# Altium schematic sheet MainBoard_sch.SchDoc
size 381 x 241 mm; SheetNumber: 1; SheetTotal: 1
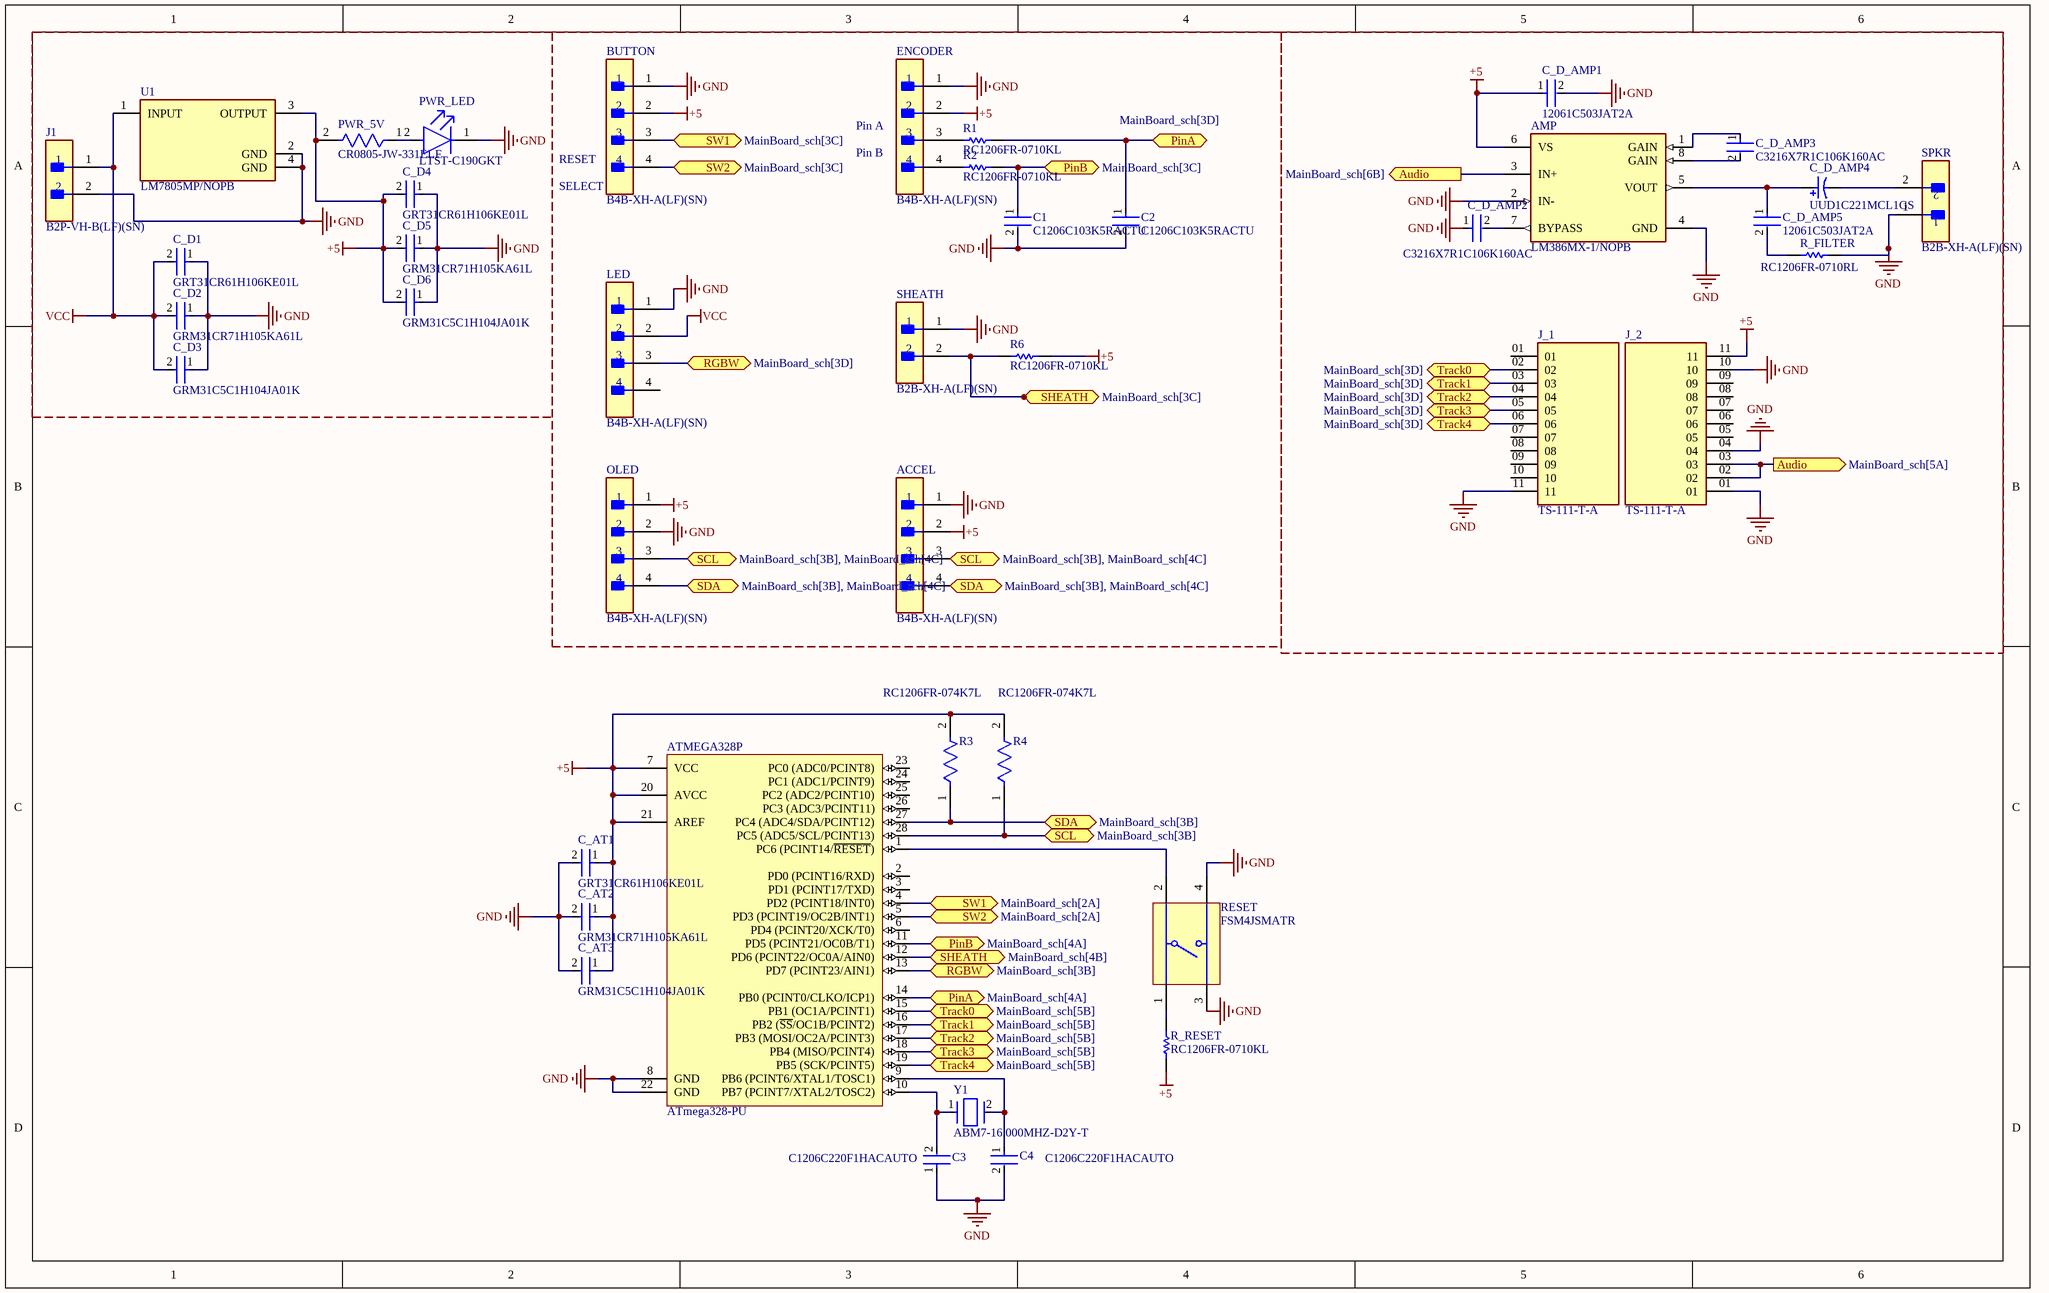
[diagram p0: MainBoard_sch.SchDoc]

## Parts
ACCEL  B4B-XH-A(LF)(SN)  [FP-B4B-XH-A_LF_SN-MFG]
AMP  LM386MX-1/NOPB  [FP-D0008A-IPC_B]
ATMEGA328P  ATmega328-PU  [28P3]
BUTTON  B4B-XH-A(LF)(SN)  [FP-B4B-XH-A_LF_SN-MFG]
C1  C1206C103K5RACTU  [FP-C1206C-EB-MFG]
C2  C1206C103K5RACTU  [FP-C1206C-EB-MFG]
C3  C1206C220F1HACAUTO  [FP-C1206C-EB-MFG]
C4  C1206C220F1HACAUTO  [FP-C1206C-EB-MFG]
C_AT1  GRT31CR61H106KE01L  [FP-GRT31C-0_2-IPC_A]
C_AT2  GRM31CR71H105KA61L  [FP-GRT31C-0_2-IPC_A]
C_AT3  GRM31C5C1H104JA01K  [FP-GRT31C-0_2-IPC_A]
C_D1  GRT31CR61H106KE01L  [FP-GRT31C-0_2-IPC_A]
C_D2  GRM31CR71H105KA61L  [FP-GRT31C-0_2-IPC_A]
C_D3  GRM31C5C1H104JA01K  [FP-GRT31C-0_2-IPC_A]
C_D4  GRT31CR61H106KE01L  [FP-GRT31C-0_2-IPC_A]
C_D5  GRM31CR71H105KA61L  [FP-GRT31C-0_2-IPC_A]
C_D6  GRM31C5C1H104JA01K  [FP-GRT31C-0_2-IPC_A]
C_D_AMP1  12061C503JAT2A  [FP-GRM319-0_15-MFG]
C_D_AMP2  C3216X7R1C106K160AC  [FP-C3216-160-0_2-IPC_B]
C_D_AMP3  C3216X7R1C106K160AC  [FP-C3216-160-0_2-IPC_B]
C_D_AMP4  UUD1C221MCL1GS  [NIC-CAPA2-6.3X7.7_V]
C_D_AMP5  12061C503JAT2A  [FP-GRM319-0_15-MFG]
ENCODER  B4B-XH-A(LF)(SN)  [FP-B4B-XH-A_LF_SN-MFG]
J1  B2P-VH-B(LF)(SN)  [FP-B2P-VH-B_LF_SN-MFG]
J_1  TS-111-T-A  [SAMTEC_TS-111-T-A]
J_2  TS-111-T-A  [SAMTEC_TS-111-T-A]
LED  B4B-XH-A(LF)(SN)  [FP-B4B-XH-A_LF_SN-MFG]
OLED  B4B-XH-A(LF)(SN)  [FP-B4B-XH-A_LF_SN-MFG]
PWR_5V  CR0805-JW-331ELF  [FP-CR0805-IPC_B]
PWR_LED  LTST-C190GKT  [FP-LTST-C190GKT-MFG]
R1  RC1206FR-0710KL  [RESC3116X65X40ML10T20]
R2  RC1206FR-0710KL  [RESC3116X65X40ML10T20]
R3  RC1206FR-074K7L  [FP-RC1206-0_65-IPC_B]
R4  RC1206FR-074K7L  [FP-RC1206-0_65-IPC_B]
R6  RC1206FR-0710KL  [RESC3116X65X40ML10T20]
R_FILTER  RC1206FR-0710RL  [RESC3116X65X40ML10T20]
R_RESET  RC1206FR-0710KL  [RESC3116X65X40ML10T20]
RESET  FSM4JSMATR  [TECO-FSM4JSMATR_V]
SHEATH  B2B-XH-A(LF)(SN)  [FP-B2B-XH-A_LF_SN-MFG]
SPKR  B2B-XH-A(LF)(SN)  [FP-B2B-XH-A_LF_SN-MFG]
U1  LM7805MP/NOPB  [FP-DCY0004A-MFG]
Y1  ABM7-16.000MHZ-D2Y-T  [FP-ABM7-MFG]

## Ports
Audio (out, see MainBoard_sch[5A]), Audio (out, see MainBoard_sch[6B]), PinA (bidir, see MainBoard_sch[3D]), PinA (bidir, see MainBoard_sch[4A]), PinB (bidir, see MainBoard_sch[3C]), PinB (bidir, see MainBoard_sch[4A]), RGBW (bidir, see MainBoard_sch[3B]), RGBW (bidir, see MainBoard_sch[3D]), SCL (bidir, see MainBoard_sch[3B]), SCL (bidir, see MainBoard_sch[3B], MainBoard_sch[4C]), SDA (bidir, see MainBoard_sch[3B]), SDA (bidir, see MainBoard_sch[3B], MainBoard_sch[4C]), SHEATH (bidir, see MainBoard_sch[3C]), SHEATH (bidir, see MainBoard_sch[4B]), SW1 (bidir, see MainBoard_sch[2A]), SW1 (bidir, see MainBoard_sch[3C]), SW2 (bidir, see MainBoard_sch[2A]), SW2 (bidir, see MainBoard_sch[3C]), Track0 (bidir, see MainBoard_sch[3D]), Track0 (bidir, see MainBoard_sch[5B]), Track1 (bidir, see MainBoard_sch[3D]), Track1 (bidir, see MainBoard_sch[5B]), Track2 (bidir, see MainBoard_sch[3D]), Track2 (bidir, see MainBoard_sch[5B]), Track3 (bidir, see MainBoard_sch[3D]), Track3 (bidir, see MainBoard_sch[5B]), Track4 (bidir, see MainBoard_sch[3D]), Track4 (bidir, see MainBoard_sch[5B])

## Nets
+5: ACCEL.2 AMP.6(VS) ATMEGA328P.7(VCC) ATMEGA328P.20(AVCC) ATMEGA328P.21(AREF) BUTTON.2 C_AT1.1 C_AT2.1 C_AT3.1 C_D4.2 C_D5.2 C_D6.2 C_D_AMP1.1 ENCODER.2 J_2.11 OLED.1 PWR_5V.2 R3.2 R4.2 R6.1 R_RESET.2 U1.3(OUTPUT)
GND: ACCEL.1 AMP.2(IN-) AMP.4(GND) ATMEGA328P.8(GND) ATMEGA328P.22(GND) BUTTON.1 C1.2 C2.2 C3.1 C4.2 C_AT1.2 C_AT2.2 C_AT3.2 C_D1.1 C_D2.1 C_D3.1 C_D4.1 C_D5.1 C_D6.1 C_D_AMP1.2 C_D_AMP2.1 ENCODER.1 J1.2 J_1.11 J_2.01 J_2.04 J_2.10 LED.1 OLED.2 PWR_LED.1(C) R_FILTER.2 RESET.3 RESET.4 SHEATH.1 SPKR.1 U1.2(GND) U1.4(GND)
VCC: C_D1.2 C_D2.2 C_D3.2 J1.1 LED.2 U1.1(INPUT)
Audio: AMP.3(IN+) J_2.02 J_2.03 ; port Audio
PinA: ATMEGA328P.14(PB0_(PCINT0/CLKO/ICP1)) C2.1 R1.2 ; port PinA
PinB: ATMEGA328P.11(PD5_(PCINT21/OC0B/T1)) C1.1 R2.2 ; port PinB
RGBW: ATMEGA328P.13(PD7_(PCINT23/AIN1)) LED.3 ; port RGBW
SCL: ACCEL.3 ATMEGA328P.28(PC5_(ADC5/SCL/PCINT13)) OLED.3 R4.1 ; port SCL
SDA: ACCEL.4 ATMEGA328P.27(PC4_(ADC4/SDA/PCINT12)) OLED.4 R3.1 ; port SDA
SHEATH: ATMEGA328P.12(PD6_(PCINT22/OC0A/AIN0)) R6.2 SHEATH.2 ; port SHEATH
SW1: ATMEGA328P.4(PD2_(PCINT18/INT0)) BUTTON.3 ; port SW1
SW2: ATMEGA328P.5(PD3_(PCINT19/OC2B/INT1)) BUTTON.4 ; port SW2
Track0: ATMEGA328P.15(PB1_(OC1A/PCINT1)) J_1.02 ; port Track0
Track1: ATMEGA328P.16(PB2_(~{SS}/OC1B/PCINT2)) J_1.03 ; port Track1
Track2: ATMEGA328P.17(PB3_(MOSI/OC2A/PCINT3)) J_1.04 ; port Track2
Track3: ATMEGA328P.18(PB4_(MISO/PCINT4)) J_1.05 ; port Track3
Track4: ATMEGA328P.19(PB5_(SCK/PCINT5)) J_1.06 ; port Track4
NetAMP_1: AMP.1(GAIN) C_D_AMP3.1
NetAMP_5: AMP.5(VOUT) C_D_AMP4.1 C_D_AMP5.1
NetAMP_7: AMP.7(BYPASS) C_D_AMP2.2
NetAMP_8: AMP.8(GAIN) C_D_AMP3.2
NetATMEGA328P_1: ATMEGA328P.1(PC6_(PCINT14/~{RESET})) RESET.2
NetATMEGA328P_9: ATMEGA328P.9(PB6_(PCINT6/XTAL1/TOSC1)) C4.1 Y1.2
NetATMEGA328P_10: ATMEGA328P.10(PB7_(PCINT7/XTAL2/TOSC2)) C3.2 Y1.1
NetC_D_AMP4_2: C_D_AMP4.2 SPKR.2
NetC_D_AMP5_2: C_D_AMP5.2 R_FILTER.1
NetENCODER_3: ENCODER.3 R1.1
NetENCODER_4: ENCODER.4 R2.1
NetPWR_5V_1: PWR_5V.1 PWR_LED.2(A)
NetR_RESET_1: R_RESET.1 RESET.1

Not connected (* = marked no-connect by the designer): ATMEGA328P 2(PD0_(PCINT16/RXD)) 3(PD1_(PCINT17/TXD)) 6(PD4_(PCINT20/XCK/T0)) 23(PC0_(ADC0/PCINT8)) 24(PC1_(ADC1/PCINT9)) 25(PC2_(ADC2/PCINT10)) 26(PC3_(ADC3/PCINT11)); J_1 01 07 08 09 10; J_2 05 06 07 08 09; LED 4

## Notes on the sheet
- (near BUTTON) RESET
- (near ENCODER) Pin A
- (near ENCODER) Pin B
- (near BUTTON) SELECT

## Library data of the parts
ACCEL BUTTON ENCODER LED OLED = CMP-17439-000250-1: CONN HEADER VERT 4POS 2.5MM; Number of Contacts: 4; Contact Resistance: 20mR; Voltage Rating: 250V; Max Current Rating: 3A; Gender: Male; Wire/Cable Gauge: 22AWG; Mated Stacking Heights: 9.8mm; Insulation Resistance: 1GR; Orientation: Straight; Contact Type: Male Pin; Contact Finish - Mating: TIN; Series: XH; Max Voltage Rating (AC): 250V; Lead Pitch: 2.5mm; Contact Shape: Square; Insulation Color: Natural; Termination: Solder; Lead Free: Lead Free; Voltage Rating (AC): 250V; Number of Rows: 1; Flammability Rating: UL94 V-0; Number of Positions: 4; Max Operating Temperature: 85°C; Package Quantity: 500; Mount: Through Hole; REACH SVHC: No SVHC; Connector Type: Header; Insulation Material: Nylon; Fastening Type: Detent; Min Operating Temperature: -25°C; Housing Color: White; Packaging: Bulk; Contact Plating: Tin; Contact Material: Brass; Max Voltage Rating (DC): 250V; Housing Material: Polyamide; Color: Natural; Material: Polyamide; Pitch: 2.5mm; Depth: 5.75mm; Current Rating: 3A; Length: 12.4mm
AMP = CMP-0994-00003-2: IC AMP CLASS AB MONO 325MW 8SOIC; Max Power Dissipation: 730mW; Nominal Supply Current: 4mA; Voltage Gain: 46dB; Power Supply Rejection Ratio (PSRR): 50dB; Gain: 20dB; Max Supply Voltage: 12V; Load Impedance: 8R; Min Supply Voltage: 4V; Bandwidth: 300kHz; Input Bias Current: 250nA; Supply Type: Single; Number of Channels: 1; Operating Supply Voltage: 9V; Case/Package: D; Power Dissipation: 730mW; Max Output Power: 325mW; Lead Free: Lead Free; Supply Current: 4mA; Number of Pins: 8; Contact Plating: Tin; RoHS Compliant: Yes; Packaging: Tape and Reel; Min Operating Temperature: 0°C; REACH SVHC: No SVHC; Output Power: 325mW; Package Quantity: 2500; Max Operating Temperature: 70°C; Radiation Hardening: No; Series: LM386
ATMEGA328P = CMP-0095-00015-2: 8-bit AVR Microcontroller, 32KB Flash, 1KB EEPROM, 2KB SRAM, 28-pin PDIP, Industrial Grade (-40°C to 85°C); ComponentLink3Description: ATmega48A/48PA/88A/88PA/168A/168PA/328/328P Summary; RevisionNote: DatasheetVersion updated. URLs added.; DatasheetVersion: revD, May-2011; ComponentLink1URL: http://www.atmel.com/; PackageVersion: revB, Sep-2001; PackageDescription: 28-lead (0.300"/7.62mm Wide) Plastic Dual Inline Package (PDIP); PackageReference: 28P3; ComponentLink1Description: Manufacturer URL; ComponentLink2Description: ATmega48A/48PA/88A/88PA/168A/168PA/328/328P Datasheet; ComponentLink3URL: http://www.atmel.com/dyn/resources/prod_documents/8271S.pdf; ComponentLink2URL: http://www.atmel.com/dyn/resources/prod_documents/8271.pdf
C1 C2 = CMP-2000-06008-2: CAP CER 10000PF 50V X7R 1206; Manufacturer: KEMET; Material: Ceramic; Temperature Coefficient: 15%; Capacitance: 10,000 pF; Automotive Grade: Grade 0; Value: 10,000 pF; Tolerance: 0.1; Height: 0.88mm; Digikey Description: CAP CER 10000PF 50V X7R 1206; Temperature Range Low: -55°C; Temperature: -55°C to +150°C; Temperature Range High: +150°C; Automotive: Yes; RoHS: TRUE; Lead Free: Yes; Device Class L3: Ceramic Capacitors; Device Class L2: Capacitors; Device Class L1: Passive Components; Octopart: https://octopart.com/c1206c103k5ractu-kemet-130245; Category: Cap; ComponentLink2Description: Datasheet; Mouser Description: Multilayer Ceramic Capacitors MLCC - SMD/SMT 50volts 10000pF X7R 10%; ComponentLink2URL: https://content.kemet.com/datasheets/KEM_C1007_X8R_ULTRA_150C_SMD.pdf; Voltage Rating: 50 V; Package: C1206C-EB; Manufacturer Part Number: C1206C103K5RACTU; Temperature Characteristic: X7R; Ipc Land Pattern Name: CAPC320160X78
C3 C4 = CMP-03020-023717-1: C1206 22 pF X8R 1.00% 100 V; Manufacturer: KEMET; Automotive Grade: Grade 0; Capacitance: 22 pF; Tolerance: 0.01; Temperature Coefficient: 15%; Voltage Rating: 100 V; Value: 22 pF; Material: Ceramic; ComponentLink2Description: Datasheet; Manufacturer Part Number: C1206C220F1HACAUTO; RoHS: TRUE; Temperature Range High: +150°C; Ipc Land Pattern Name: CAPC320160X78; Package: C1206C-EB; Device Class L3: Ceramic Capacitors; Height: 0.88mm; Lead Free: Yes; Device Class L2: Capacitors; Category: Cap; Automotive: Yes; Temperature Characteristic: X8R; ComponentLink2URL: https://content.kemet.com/datasheets/KEM_C1007_X8R_ULTRA_150C_SMD.pdf; Device Class L1: Passive Components; Temperature Range Low: -55°C; Temperature: -55°C to +150°C; Octopart: https://octopart.com/c1206c220f1hacauto-kemet-88102108
C_AT1-C_AT3 C_D1-C_D6 = CMP-06035-000076-2: Multi-Layer Ceramic Capacitor 10uF 50V X5R ±10% 1206 Emboss T/R; Length: 0.126inch; Max Operating Temperature: 85°C; Width: 0.063inch; Ratings: AEC-Q200; Voltage Rating: 50V; Dielectric: X5R; Min Operating Temperature: -55°C; Case Code (Imperial): 1206; Capacitance: 10uF; Case Code (Metric): 3216; Thickness: 0.071inch; Tolerance: 10%; Mount: Surface Mount; Case/Package: 1206; Packaging: Cut Tape; Voltage Rating (DC): 50V
C_D_AMP1 = CMP-06035-028588-1: Chip Multilayer Ceramic Capacitors for General Purpose, 1206, 0.05uF, C0G, 30ppm/°C, 5%, 50V
C_D_AMP2 C_D_AMP3 = CMP-08246-002980-1: Multilayer Ceramic Capacitors 10uF ±10% 16V X7R SMD 1206; Termination: SMD/SMT; Package Quantity: 1; Min Operating Temperature: -55°C; Case Code (Imperial): 1206; Resistor Type: Ceramic; Number of Pins: 2; Lead Free: Lead Free; RoHS Compliant: Yes; Packaging: Tape and Reel; Dielectric: X7R; Thickness: 0.071inch; Tolerance: 10%; Voltage Rating (DC): 16V; Length: 3.2mm; Voltage Rating: 16V; Voltage: 16V; Capacitance: 10uF; REACH SVHC: No SVHC; Series: C; Height: 1.6mm; Construction: Flat; Case/Package: 1206; Max Operating Temperature: 125°C; Case Code (Metric): 3216; Depth: 1.6mm; Weight: 0.000571oz; Dielectric Material: Ceramic; Width: 0.063inch; Mount: Surface Mount
C_D_AMP4 = CMP-0687-00060-1: Aluminum Electrolytic Capacitor, UD Series, Low Impedance, 220 uF, 16 V, + / - 20%, -55 to 105 degC, Chip Type, 6.3 x 7.7 mm D x L, Pb-Free, Reel; Manufacturer: Nichicon; Impedance: 0.34 Ohm; Tolerance Rated Capacitance: -20 to 20%; Rated Voltage: 16 V; Rated Capacitance: 220 uF; Endurance Time: 2000 h; Rated Ripple Current (at 100kHz): 280 mA; Packing: Dia382mm Reel; PackageReference: CAPAE-D6.3H7.7; DatasheetVersion: 08/2012; PartNumber: UUD1C221MCL1GS; ComponentLink1URL: http://www.nichicon.co.jp/; ComponentLink3URL: http://products.nichicon.co.jp/en/pdf/XJA043/e-ud.pdf; PackageDescription: 2-Pin Surface Mount Device, Diameter 6.3 mm, Height 7.7 mm, Pitch 5.4 mm; ComponentLink3Description: Package Specification; Length: 7.7 mm; RoHS: TRUE; Mounting Technology: Surface Mount; ComponentLink2Description: Datasheet; ComponentLink2URL: http://products.nichicon.co.jp/en/pdf/XJA043/e-ud.pdf; Diameter: 6.3 mm; ComponentLink1Description: Manufacturer URL
C_D_AMP5 = CMP-06035-028588-1: Chip Multilayer Ceramic Capacitors for General Purpose, 1206, 0.10uF, C0G, 30ppm/°C, 5%, 50V
J1 = CMP-17439-000297-1: CONN HEADER VERT 2POS 3.96MM; Number of Positions: 2; Pitch: 0.156inch; Voltage Rating: 250V; Termination: Solder; Lead Free: Lead Free; Insulation Color: Natural; Contact Material: Brass; Flammability Rating: UL94 V-0; Packaging: Bulk; Contact Mating Length: 0.303inch; Color: Natural; Contact Shape: Square; Contact Plating: Tin; Number of Rows: 1; Insulation Material: PBT; Connector Type: Header; Contact Finish - Mating: TIN; Mount: Through Hole; Fastening Type: Friction; Contact Type: Male Pin; Series: VH
J_1 J_2 = TS-111-T-A: MF: {'manufacturer': u'Samtec Inc.'}; Package: None; Price: None; Value: *; MP: TS-111-T-A; Availability: Unavailable
PWR_5V = CMP-07231-005909-1: Thick Film Chip Resistors 0805 330Ω 0.125W 5% 200ppm/°C; Voltage Rating (DC): 150V; Max Power Dissipation: 125mW; Resistance: 330R; Min Operating Temperature: -55°C; Number of Terminations: 2; Width: 0.049inch; Number of Pins: 2; REACH SVHC: No SVHC; Contact Plating: Tin; Max Operating Temperature: 155°C; Mount: Surface Mount; Case Code (Metric): 2012; Length: 2mm; Package Quantity: 1; Tolerance: 5%; Composition: Thick Film; Packaging: Tape and Reel; Case Code (Imperial): 0805; Radiation Hardening: No; Height: 0.024inch; Thickness: 508um; Case/Package: 0805; Termination: SMD/SMT; Voltage Rating: 150V; Power Rating: 125mW; Depth: 1.25mm; Temperature Coefficient: 200ppm/°C; Features: Moisture Resistant; Military Standard: Not
PWR_LED = CMP-22017-000005-2: LED GREEN CLEAR CHIP SMD; Dominant Wavelength: 569nm; Reverse Voltage: 5V; Lens Color: Colorless; Viewing Angle: 130°; Voltage: 2V; Forward Current: 30mA; Power Dissipation: 100mW; Luminous Intensity: 6mcd; Number of LEDs: 1; Forward Voltage: 2.1V; Wavelength: 565nm; Test Current: 10mA; Min Operating Temperature: -55°C; Lens Style: Clear; Mount: Surface Mount; Width: 0.8mm; Packaging: Tape and Reel; Lens Transparency: Clear; Case Code (Metric): 1608; Depth: 0.8mm; Case Code (Imperial): 0603; Case/Package: 0603; Number of Pins: 2; Max Operating Temperature: 85°C; Lead Free: Lead Free; Number of Elements: 1; Length: 1.6mm; Height: 0.8mm; Package Quantity: 1; Power Rating: 100mW; Radiation Hardening: No; Illumination Color: Green; Color: Green
R1 R2 R6 R_RESET = CMP-1014-00623-2: Chip Resistor, 10 KOhm, +/- 1%, 0.25 W, -55 to 155 degC, 1206 (3216 Metric), RoHS, Tape and Reel; Manufacturer: Yageo; Voltage Rating: 200V; Resistance: 10KOhm; Temperature Coefficient: 100ppm/degreesC; Power Rating: 250mW; Packaging: TapeandReel; Termination: SMD/SMT; REACH SVHC: Unknown; Tolerance: 1%; Height: 0.55mm; Composition: ThickFilm; Max Operating Temperature: 155degC; Datasheet Version: Rev. 5, 10/2016; Lead Free: LeadFree; Case Code (Metric): 3216; Depth: 1.6mm; Package Quantity: 5000; RoHSCompliant: true; Military Standard: Not; Case/Package: 1206; Case Code (Imperial): 1206; Min Operating Temperature: -55degC; Datasheet URL: http://www.yageo.com/NewPortal/yageodocoutput?fileName=/pdf/R-Chip/PYu-RC_Group_51_RoHS_L_5.pdf; Length: 3.1mm; Manufacturer URL: http://www.yageo.com/; Package Reference: 1206.0; Width: 1.6mm; Package Description: 2-Pin Surface Mount Device, Body 3.1 x 1.6 mm
R3 R4 = CMP-03412-037805-1: RES SMD 4.7K OHM 1% 1/4W 1206; Max Power Dissipation: 250mW; Voltage Rating: 200V; Temperature Coefficient: 100ppm/°C; Resistance: 4.7kR; Construction: Rectangular; RoHS Compliant: Yes; Max Operating Temperature: 155°C; Tolerance: 1%; Height: 0.026inch; Features: Moisture Resistant; Military Standard: Not; Series: RC; Termination: SMD/SMT; Number of Terminations: 2; Number of Pins: 2; Case Code (Imperial): 1206; Case/Package: 1206; Case Code (Metric): 3216; Voltage Rating (DC): 200V; Width: 0.063inch; Min Operating Temperature: -55°C; Resistance Tolerance: 1%; Length: 0.122inch; Size Code: 1206; Lead Free: Lead Free; Depth: 1.6mm; Packaging: Tape and Reel; Package Quantity: 1; Power Rating: 250mW; Resistor Type: Thick Film
R_FILTER = CMP-2100-03677-1: Chip Resistor, 10 Ohm, +/- 1%, 0.25 W, -55 to 155 degC, 1206 (3216 Metric), RoHS, Tape and Reel; Manufacturer: Yageo; Voltage Rating (DC): 200V; Resistance: 10Ohm; Power Rating: 250mW; Temperature Coefficient: 200ppm/degreesC; Military Standard: Not; Package Description: 2-Pin Surface Mount Device, Body 3.1 x 1.6 mm; Packaging: TapeandReel; Datasheet Version: Rev. 5, 10/2016; Length: 3.1mm; Manufacturer URL: http://www.yageo.com/; Voltage Rating: 200V; Height: 0.026inch; REACH SVHC: Unknown; Max Operating Temperature: 155degC; Case Code (Imperial): 1206; Package Reference: 1206.0; RoHSCompliant: true; Termination: SMD/SMT; Lead Free: LeadFree; Composition: ThickFilm; Tolerance: 1%; Package Quantity: 1; Min Operating Temperature: -55degC; Datasheet URL: http://www.yageo.com/NewPortal/yageodocoutput?fileName=/pdf/R-Chip/PYu-RC_Group_51_RoHS_L_5.pdf; Number of Pins: 2; Width: 0.063inch; Case Code (Metric): 3216; Max Power Dissipation: 250mW; Depth: 1.6mm; Number of Terminations: 2; Case/Package: 1206
RESET = CMP-2000-07486-1: Micro Miniature Push Button Switch FSM JSM, 50 mA, -35 to 85 degC, 4-Pin SMD, RoHS, Tape and Reel; Manufacturer: TE Connectivity; Mechanical Life: 100000Cycles; Current Rating: 50mA; Actuator Material: Polyamide; Max Voltage Rating (DC): 12V; Capacitance: 0f; Illumination Type: Illuminated; Voltage Rating (DC): 24V; Case\/Package: SMD/SMT; Operating Force: 160gf; Contact Resistance: 100mOhm; Actuator Length: 0.055inch; Switch Travel: 0.25mm; Throw Configuration: SPST; Termination: GullWing; Contact Plating: Silver; Orientation: Straight; Mounting Technology: SurfaceMount; REACH SVHC: Unknown; Electrical Life: 100000Cycles; Package Reference: FSM4JSMATR; Max Operating Temperature: 85degC; Manufacturer URL: http://www.te.com/; Package Description: 4-Pin Surface Mount Device, Body 6 x 6 mm, Pitch 4.5 mm; Datasheet Version: Rev. V, 02/2015; Packaging: TapeandReel; Min Operating Temperature: -35degC; Mount: SurfaceMount; Contact Current Rating: 50mA; Contact Material: CopperAlloy; Package Quantity: 1200; Datasheet URL: http://www.te.com/commerce/DocumentDelivery/DDEController?Action=showdoc&DocId=Customer+Drawing%7F2-1437565-7%7FV%7Fpdf%7FEnglish%7FENG_CD_2-1437565-7_V.pdf%7F4-1437565-2; RoHSCompliant: true
SHEATH SPKR = CMP-2000-05888-3: CONN HEADER VERT 2POS 2.5MM; Current Rating: 3A; Voltage Rating: 250V; Number of Contacts: 2; Contact Resistance: 20mR; Wire/Cable Gauge: 22AWG; Insulation Resistance: 1GR; Connector Type: Male Pin; Packaging: Bulk; Contact Material: Brass; Lead Free: Lead Free; Orientation: Straight; Contact Plating: Tin; Max Current Rating: 3A; Termination: Solder; Fastening Type: Detent; Depth: 5.75mm; Housing Material: Polyamide; REACH SVHC: No SVHC; Series: XH; Voltage Rating (AC): 250V; Number of Positions: 2; Color: Natural; Contact Type: Male Pin; Max Voltage Rating (DC): 250V; Pitch: 2.5mm; Lead Pitch: 2.5mm; Mount: Through Hole; Max Operating Temperature: 85°C; Length: 7.4mm; Max Voltage Rating (AC): 250V; Min Operating Temperature: -25°C; Number of Rows: 1; Housing Color: White
U1 = CMP-04917-000007-1: IC REG LINEAR 5V 1.5A SOT223-4; Manufacturer: Texas Instruments; Max Supply Voltage: 30V; Max Junction Temp: +150°C; Number Of Outputs: 1; Standoff Height: 0.02mm; Dropout Voltage: 2V; Accuracy Percentage: 3%; Nominal Supply Current: 8mA; Output Type: Fixed; Min Supply Voltage: 7.5V; Lead Free: Yes; Device Class L1: Integrated Circuits (ICs); Manufacturer Part Number: LM7805MP/NOPB; Package: DCY0004A; ComponentLink2Description: Datasheet; Temperature Range Low: 0°C; ComponentLink2URL: http://www.ti.com/lit/ds/symlink/lm7800.pdf; Height: 1.8mm; Temperature: 0°C to +125°C; Category: IC; Device Class L3: Voltage Regulators - Linear; Octopart: https://octopart.com/lm7805mp%2Fnopb-texas+instruments-74629991; Device Class L2: Power Management ICs; Output Voltage: 5V; RoHS: TRUE; Temperature Range High: +125°C; Automotive: No; Digikey Description: IC REG LINEAR 5V 1.5A SOT223-4; Output Current: 1.5A
Y1 = CMP-27762-000095-1: Crystal 16MHz ±20ppm 18pF SMD-2 6mm x 3.5mm; ESR (Equivalent Series Resistance): 50R; Frequency Stability: 30ppm; Width: 3.3mm; Frequency: 16MHz; Radiation Hardening: No; Height: 0.055inch; Tolerance: 20ppm; Length: 6mm; Case/Package: CSMD; Lead Free: Lead Free; Min Operating Temperature: -40°C; Termination: SMD/SMT; Operating Frequency: 16 MHz; Resistor Type: Ceramic; Packaging: Tape and Reel; Mount: Surface Mount; Load Capacitance: 18pF; Frequency Tolerance: 20ppm; Depth: 3.5mm; Series: ABM7; Package Quantity: 1000; Max Operating Temperature: 85°C; Number of Pins: 2